# Altium schematic sheet Fleet-Monitor-Power.SchDoc: Fleet Monitor
size A4; Subtitle: Power Distribution; DocumentNumber: 7; Revision: V1.0; SheetNumber: 2; SheetTotal: 8; Author: Florian Baumgartner & Luca Jost
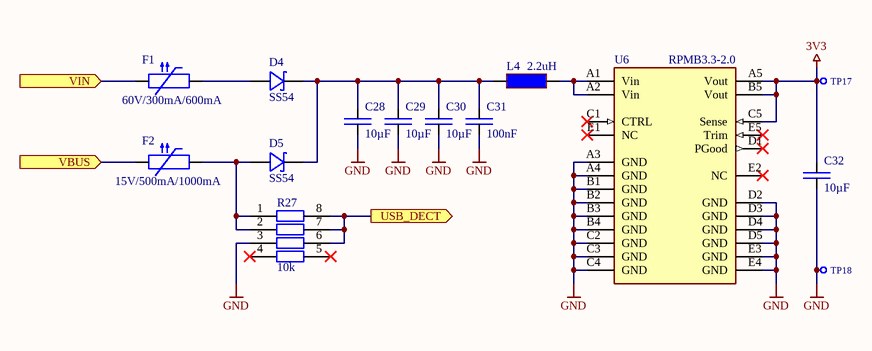
[diagram p0: Fleet-Monitor-Power.SchDoc]

## Parts
C28  10µF  [SMD Keramikkondensator 0805]
C29  10µF  [SMD Keramikkondensator 0805]
C30  10µF  [SMD Keramikkondensator 0805]
C31  100nF  [SMD Keramikkondensator 0603]
C32  10µF  [SMD Keramikkondensator 0603]
D4  SS54  [SMD Diode DO-214-AC]
D5  SS54  [SMD Diode DO-214-AC]
F1  60V/300mA/600mA  [SMD PPTC-Fuse 1812]
F2  15V/500mA/1000mA  [SMD PPTC-Fuse 1206]
L4  2.2uH  [SMD INDUCTOR/FERRITE 0805]
R27  10k  [SMD Widerstand Array 4-Fach 0603]
TP17  X-TP  [SMD Testpunkt Ø1mm]  (value not drawn)  (no BOM)
TP18  X-TP  [SMD Testpunkt Ø1mm]  (value not drawn)  (no BOM)
U6  RPMB3.3-2.0  [SMD DCDC RPM 2.0]

## Ports
USB_DECT (out), VBUS (in), VIN (in)

## Nets
3V3: C32.2 TP17.1 U6.A5(Vout) U6.B5(Vout) U6.C5(Sense)
GND: C28.1 C29.1 C30.1 C31.1 C32.1 R27.3 TP18.1 U6.A3(GND) U6.A4(GND) U6.B1(GND) U6.B2(GND) U6.B3(GND) U6.B4(GND) U6.C2(GND) U6.C3(GND) U6.C4(GND) U6.D2(GND) U6.D3(GND) U6.D4(GND) U6.D5(GND) U6.E3(GND) U6.E4(GND)
USB_DECT: R27.6 R27.7 R27.8 ; port USB_DECT
VBUS: F2.1 ; port VBUS
VIN: F1.1 ; port VIN
NetC28_2: C28.2 C29.2 C30.2 C31.2 D4.K D5.K L4.1
NetD4_A: D4.A F1.2
NetD5_A: D5.A F2.2 R27.1 R27.2
NetL4_2: L4.2 U6.A1(Vin) U6.A2(Vin)

Not connected (* = marked no-connect by the designer): R27 4* 5*; U6 C1(CTRL)* D1(PGood)* E1(NC)* E2(NC)* E5(Trim)*

## Notes on the sheet
- Title
- Author:
- Subtitle
- Date:
- Rev:
- File:
- Sheet
- of

## Library data of the parts
C28-C30 = E6 - 10uF: SMD Ceramic Capacitor E6; Component Value: 10µF 50V; Component Description: Multilayer Ceramic Capacitors MLCC; ComponentLink1Description: Datasheet; ComponentLink1URL: https://datasheet.lcsc.com/lcsc/2004251506_Murata-Electronics-GRM21BR61H106KE43L_C440198.pdf; Digikey: 490-18663-1-ND; Farnell: 3790440; JLC-Parts: C440198; Mouser: 81-GRM21BR61H106KE3L; Unit Price: 0.13
C31 = E6 - 100nF: SMD Ceramic Capacitor E6; Component Value: 100nF 50V; Component Description: Multilayer Ceramic Capacitors MLCC; ComponentLink1Description: Datasheet; ComponentLink1URL: https://datasheet.lcsc.com/lcsc/1809301912_YAGEO-CC0603KRX7R9BB104_C14663.pdf; Digikey: 445-6899-1-ND; Farnell: 2210822; JLC-Parts: C14663; Mouser: 810-CGA2B3X7R1H104K; Unit Price: 0.01
C32 = E6 - 10uF: SMD Ceramic Capacitor E6; Component Value: 10µF 10V; Component Description: Multilayer Ceramic Capacitors MLCC; ComponentLink1Description: Datasheet; ComponentLink1URL: https://datasheet.lcsc.com/lcsc/1810191219_Samsung-Electro-Mechanics-CL10A106KP8NNNC_C19702.pdf; Digikey: 587-3258-1-ND; Farnell: 2113070; JLC-Parts: C19702; Mouser: 963-LMK107BBJ106MALT; Unit Price: 0.01
D4 D5 = SS54: 40V 5A 550mV @ 5A SMA(DO-214AC) Schottky Barrier Diodes (SBD) ROHS; ComponentLink1Description: Datasheet; ComponentLink1URL: https://datasheet.lcsc.com/lcsc/1810192041_MDD%EF%BC%88Microdiode-Electronics%EF%BC%89-SS54_C22452.pdf; Component Value: SS54; Digikey: 641-SS54-HFCT-ND; Farnell: 1861427; JLC-Parts: C22452; Mouser: 750-SS54-HF; Unit Price: 0.10; Component Description: Schottky Barrier Diode
F1 = JK-nSMD010: 60V 250mA 1s 1206 Resettable Fuses; Component Value: 60V/300mA/600mA/100ms; Component Description: PTC Resettable Fuse; ComponentLink1Description: Datasheet; ComponentLink1URL: https://datasheet.lcsc.com/lcsc/1809211319_RUILON-Shenzhen-Ruilongyuan-Elec-SMD1812P030TF-60V_C117855.pdf; Digikey: F8131CT-ND; Farnell: 1961501; JLC-Parts: C117855; Mouser: 576-1812L035/60MR; Unit Price: 0.07
F2 = nSMD020-30V: 30V 460mA 1206 Resettable Fuses; Component Value: 15V/500mA/1000mA/100ms; Component Description: PTC Resettable Fuse; ComponentLink1Description: Datasheet; ComponentLink1URL: https://datasheet.lcsc.com/lcsc/1912111437_Littelfuse-1206L050-15YR-A_C315893.pdf; Digikey: F3733CT-ND; Farnell: 2752736; JLC-Parts: C315893; Mouser: 576-1206L050/15YR; Unit Price: 0.23
L4 = TFM201610GHM-2R2MTAA: Ferrite Bead 2.2uH 2.6A / 142mOhm; Component Description: Power Inductor; ComponentLink1Description: Datasheet; ComponentLink1URL: https://datasheet.lcsc.com/lcsc/1810061613_TDK-TFM201610GHM-2R2MTAA_C136243.pdf; Component Value: 2.2uH; Digikey: 445-173104-1-ND; Farnell: 2470314; JLC-Parts: C136243; Mouser: 810-TFM201610GHM2R2A; Unit Price: 0.13
R27 = R-Array Single Quad E24 - 10k: Isolated Resistor Array; Component Value: 10k (4x, 50V, 62.5mW, 5%); ComponentLink1Description: Datasheet; ComponentLink1URL: https://datasheet.lcsc.com/lcsc/1810191515_UNI-ROYAL-Uniroyal-Elec-4D03WGJ0103T5E_C29718.pdf; Digikey: Y4103CT-ND; Farnell: 2060167; JLC-Parts: C29718; Mouser: 667-EXB-V8V103JV; Unit Price: 0.01; Component Description: Isolated Resistor Array
TP17 TP18 = X-TP: Testpunkt; Component Value: Ø 0.8mm; Component Description: Testpoint; Unit Price: 0.00
U6 = RPMB3.3-2.0: Non-Isolated PoL Module DC DC Converter 1 Output 3.3V    2A 4V - 36V Input; Component Value: RPMB3.3-3.0; Component Description: DC-DC Stepdown Converter; ComponentLink1Description: Datasheet; ComponentLink1URL: https://recom-power.com/pdf/Innoline/RPMB-2.0.pdf; Digikey: 945-RPMB3.3-3.0CT-ND; Farnell: 3551809; Mouser: 919-RPMB3.3-3.0; Unit Price: 7.43